# EAGLE schematic box-din3 (EAGLE 5.11)
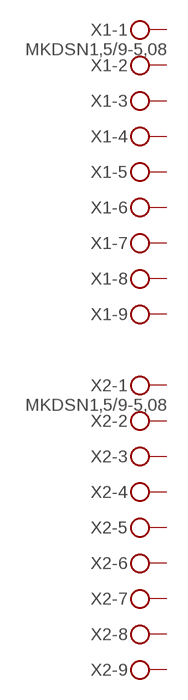
[diagram p0: schematic, sheet 1]

## Parts
X1  MKDSN1,5/9-5,08  [MKDSN1,5/9-5,08]
X2  MKDSN1,5/9-5,08  [MKDSN1,5/9-5,08]
Unconnected: X1.1 X1.2 X1.3 X1.4 X1.5 X1.6 X1.7 X1.8 X1.9 X2.1 X2.2 X2.3 X2.4 X2.5 X2.6 X2.7 X2.8 X2.9

## Library data of the parts
X1 X2 = con-phoenix-508:MKDSN1,5/9-5,08: MKDSN 1,5/ 9-5,08 Printklemme Nennstrom: 13,5 A Nennspannung: 250 V Rastermaß: 5,08 mm Polzahl: 9 Anschlussart: Schraubanschluss Montage: Löten Anschlussrichtung Leiter/Platine: 0 ° Artikelnummer: 1729199 Source: http://eshop.phoenixcontact.com .. 1729199.pdf